# Altium schematic sheet Lighting.SchDoc
size A; SheetNumber: 3; SheetTotal: 3
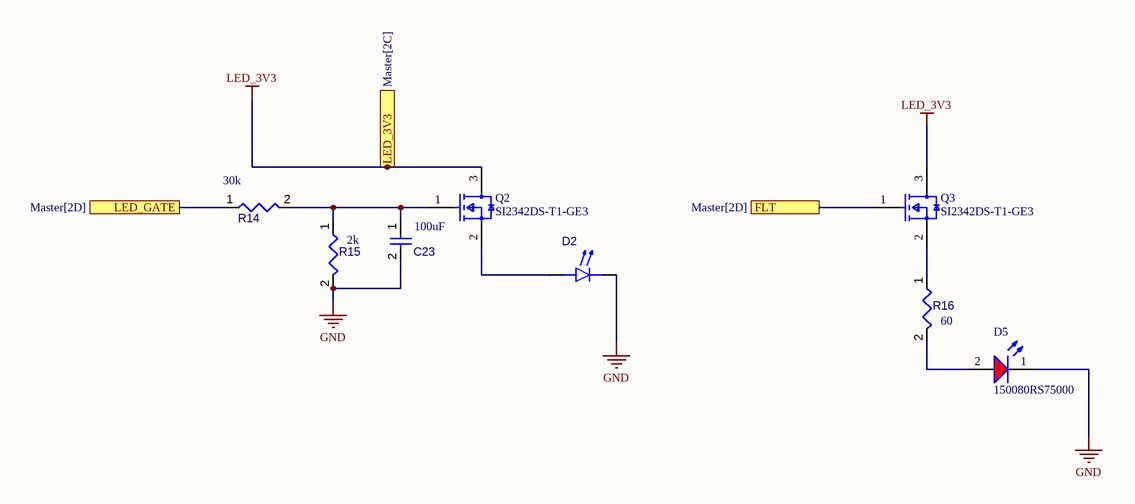
[diagram p0: Lighting.SchDoc]

## Parts
C23  value 100uF  (hidden comment: Capacitors,100uF)
D2  HL-AM-2835H489W-S1-08HL-HR3  [HL-AM-2835H489W-S1-08HL-HR3-Footprint-1]  (value not drawn)
D5  150080RS75000  [WL-SMCW_0805_150080xx75000]
Q2  SI2342DS-T1-GE3  [FP-S-03946-MFG]
Q3  SI2342DS-T1-GE3  [FP-S-03946-MFG]
R14  value 30k  (hidden comment: Resistors,30k)
R15  value 2k  (hidden comment: Resistors,2k)
R16  value 60  (hidden comment: Resistors,60)

## Ports
FLT (see Master[2D]), LED_3V3 (see Master[2C]), LED_GATE (see Master[2D])

## Nets
GND: C23.2 D2.1(K) D5.1(K) R15.2
LED_3V3: Q2.3(D) Q3.3(D) ; port LED_3V3
FLT: Q3.1(G) ; port FLT
LED_GATE: R14.1 ; port LED_GATE
NetC23_1: C23.1 Q2.1(G) R14.2 R15.1
NetD2_2: D2.2(A) Q2.2(S)
NetD5_2: D5.2(A) R16.2
NetQ3_2: Q3.2(S) R16.1

## Library data of the parts
C23 = Capacitors: Capacitor; Component Type: Capacitors
D2 = CMP-007-00036-1
D5 = CMP-1426-00011-3: LED Uni-Color Red 630nm 2-Pin Chip 0805(2012Metric) T/R; Viewing Angle: 140°; Max Junction Temperature (Tj): 95°C; Power Dissipation: 72mW; Forward Current: 100mA; Forward Voltage: 2V; Wavelength: 625nm; Test Current: 20mA; Max Reverse Voltage (DC): 5V; Luminous Intensity: 150mcd; Lens Style: Clear, Rectangular; REACH SVHC: Unknown; Height: 700µm; Case Code (Metric): 2012; Peak Wavelength: 630nm; Length: 2mm; Width: 1.25mm; RoHS: Compliant; Packaging: Tape and Reel; Dominant Wavelength: 625nm; Color: Red; Case Code (Imperial): 0805; Min Operating Temperature: -40°C; Mount: Surface Mount; Max Operating Temperature: 85°C; Case/Package: 0805
Q2 Q3 = CMP-02550-000018-1: MOSFET N-CH 8V 6A SOT-23; Manufacturer: Vishay; Number Of N Channels: 1; Pulse Drain Current: 30A; Reverse Recovery Charge: 17nC; Depletion Mode: False; Reverse Recovery Time: 40ns; Max Junction Temp: +150°C; Power Dissipation: 1.3W; Transconductance: 75S; Threshold Vgs Min: 0.35V; Turn Off Delay Time: 65ns; Rthja Max: 75°C/W; Input Capacitace At Vds: 1070pF @ 4V; Gate Charge At Vgs: 10.5nC @ 4.5V; Gate To Source Voltage: 5V; Turn On Delay Time: 6ns; Drain To Source Resistance: 0.014Ω; Typ Forward Diode Voltage: 0.82V; Standoff Height: 0.01mm; Max Forward Diode Voltage: 1.2V; Threshold Vgs Max: 0.8V; Continuous Drain Current: 6A; Device Class L1: Discrete Semiconductors; Mouser Description: MOSFET 8V 6A 2.5; Category: Trans; Digikey Description: MOSFET N-CH 8V 6A SOT-23; Manufacturer Part Number: SI2342DS-T1-GE3; Device Class L2: Transistors; Octopart: https://octopart.com/si2342ds-t1-ge3-vishay-45050957; ComponentLink2URL: https://www.vishay.com/docs/63302/si2342ds.pdf; RoHS: TRUE; Drain To Source Breakdown Voltage: 8V; Height: 1.12mm; Lead Free: Yes; Temperature Range Low: -55°C; Package: S-03946; Device Class L3: MOSFETs; Temperature Range High: +150°C; Ipc Land Pattern Name: SOT95P237X100-3; Drain To Source Voltage: 8V; Temperature: -55°C to +150°C; ComponentLink2Description: Datasheet; Number Of Channels: 1; Automotive: No
R14-R16 = Resistors: Resistor; Component Type: Resistors